# EAGLE design draft1 (EAGLE 6.2)
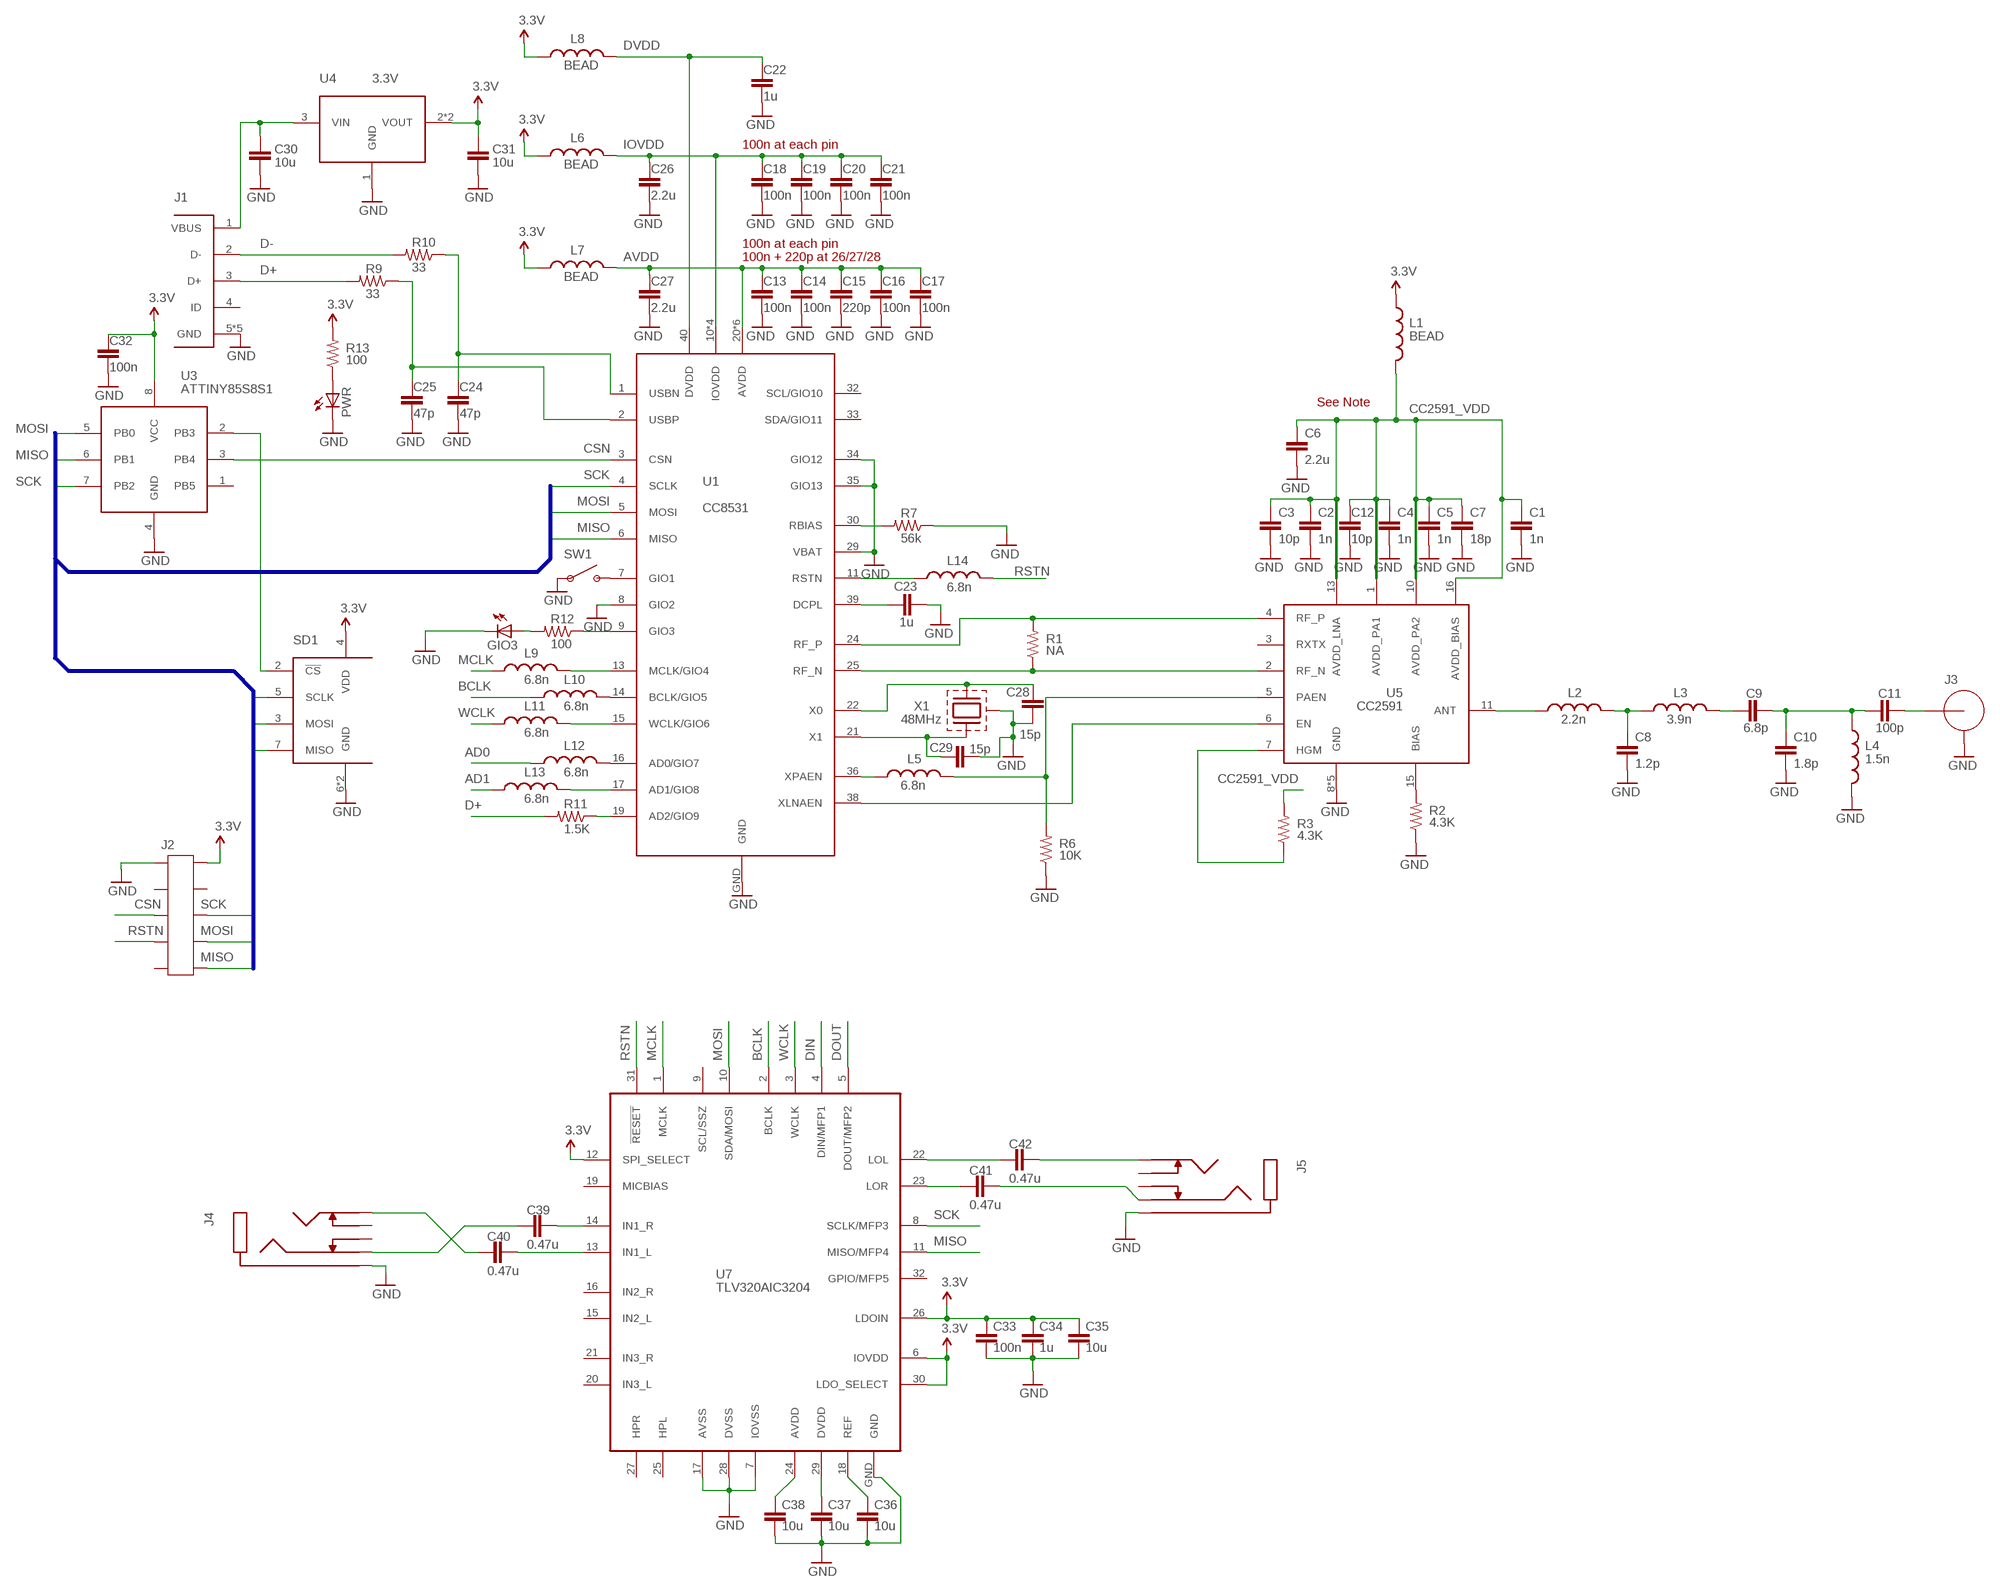
[diagram p0: schematic, sheet 1]

## Parts
C1  1n  C-EUC0603  [C0603]
C2  1n  C-EUC0603  [C0603]
C3  10p  C-EUC0603  [C0603]
C4  1n  C-EUC0603  [C0603]
C5  1n  C-EUC0603  [C0603]
C6  2.2u  C-EUC0603  [C0603]
C7  18p  C-EUC0603  [C0603]
C8  1.2p  C-EUC0603  [C0603]
C9  6.8p  C-EUC0603  [C0603]
C10  1.8p  C-EUC0603  [C0603]
C11  100p  C-EUC0603  [C0603]
C12  10p  C-EUC0603  [C0603]
C13  100n  C-EUC0603  [C0603]
C14  100n  C-EUC0603  [C0603]
C15  220p  C-EUC0603  [C0603]
C16  100n  C-EUC0603  [C0603]
C17  100n  C-EUC0603  [C0603]
C18  100n  C-EUC0603  [C0603]
C19  100n  C-EUC0603  [C0603]
C20  100n  C-EUC0603  [C0603]
C21  100n  C-EUC0603  [C0603]
C22  1u  C-EUC0603  [C0603]
C23  1u  C-EUC0603  [C0603]
C24  47p  C-EUC0603  [C0603]
C25  47p  C-EUC0603  [C0603]
C26  2.2u  C-EUC0603  [C0603]
C27  2.2u  C-EUC0603  [C0603]
C28  15p  C-EUC0603  [C0603]
C29  15p  C-EUC0603  [C0603]
C30  10u  C-EUC0603  [C0603]
C31  10u  C-EUC0603  [C0603]
C32  100n  C-EUC0603  [C0603]
C33  100n  C-EUC0603  [C0603]
C34  1u  C-EUC0603  [C0603]
C35  10u  C-EUC0603  [C0603]
C36  10u  C-EUC0603  [C0603]
C37  10u  C-EUC0603  [C0603]
C38  10u  C-EUC0603  [C0603]
C39  0.47u  C-EUC0603  [C0603]
C40  0.47u  C-EUC0603  [C0603]
C41  0.47u  C-EUC0603  [C0603]
C42  0.47u  C-EUC0603  [C0603]
GIO3  LEDCHIP-LED0603  [CHIP-LED0603]
J1  USB_MICRO_AB  [USB_MICRO_AB]
J2  HEADER-10P-SMD-MALE  [10P-0.05-HEADER]
J3  SMA  [CONSMA003.031]
J4  PHONE_SW  [35RAPC4BV4]
J5  PHONE_SW  [35RAPC4BV4]
L1  BEAD  INDUCTOR0603  [0603]
L2  2.2n  INDUCTOR0603  [0603]
L3  3.9n  INDUCTOR0603  [0603]
L4  1.5n  INDUCTOR0603  [0603]
L5  6.8n  INDUCTOR0603  [0603]
L6  BEAD  INDUCTOR0603  [0603]
L7  BEAD  INDUCTOR0603  [0603]
L8  BEAD  INDUCTOR0603  [0603]
L9  6.8n  INDUCTOR0603  [0603]
L10  6.8n  INDUCTOR0603  [0603]
L11  6.8n  INDUCTOR0603  [0603]
L12  6.8n  INDUCTOR0603  [0603]
L13  6.8n  INDUCTOR0603  [0603]
L14  6.8n  INDUCTOR0603  [0603]
PWR  LEDCHIP-LED0603  [CHIP-LED0603]
R1  NA  R-US_R0603  [R0603]
R2  4.3K  R-US_R0603  [R0603]
R3  4.3K  R-US_R0603  [R0603]
R6  10K  R-US_R0603  [R0603]
R7  56k  R-US_R0603  [R0603]
R9  33  R-US_R0603  [R0603]
R10  33  R-US_R0603  [R0603]
R11  1.5K  R-US_R0603  [R0603]
R12  100  R-US_R0603  [R0603]
R13  100  R-US_R0603  [R0603]
SD1  MICROSDDM3AT  [DM3AT]
SW1  SPST-SMD  [TACT_SW]
U1  CC8531  [S-PVQFN-N40]
U3  ATTINY85S8S1  [SOIC8]
U4  3.3V  NX1117C  [SOT-223]
U5  CC2591  [S-PVQFN-N16]
U7  TLV320AIC3204  [S-PVQFN-N32]
X1  48MHz  XTAL-ABRACONABM3C  [ABM3C]

## Nets
3.3V: C31.1 C32.1 C33.1 C34.1 C35.1 J2.2 L1.1 L6.1 L7.1 L8.1 R13.2 SD1.4(VDD) U3.8(VCC) U4.2(VOUT) U4.4(VOUT) U7.6(IOVDD) U7.12(SPI_SELECT) U7.26(LDOIN) U7.30(LDO_SELECT)
AD0: L12.1
AD1: L13.1
AVDD: C13.1 C14.1 C15.1 C16.1 C17.1 C27.1 L7.2 U1.20(AVDD) U1.23(AVDD) U1.26(AVDD) U1.27(AVDD) U1.28(AVDD) U1.31(AVDD)
BCLK: L10.1 U7.2(BCLK)
CC2591_VDD: C1.1 C2.1 C3.1 C4.1 C5.1 C6.1 C7.1 C12.1 L1.2 R3.2 U5.1(AVDD_PA1) U5.10(AVDD_PA2) U5.13(AVDD_LNA) U5.16(AVDD_BIAS)
CSN: J2.5 U1.3(CSN) U3.3(PB4)
D+: J1.3(D+) R9.2 R11.2
D-: J1.2(D-) R10.2
DIN: U7.4(DIN/MFP1)
DOUT: U7.5(DOUT/MFP2)
DVDD: C22.1 L8.2 U1.40(DVDD)
GND: C1.2 C2.2 C3.2 C4.2 C5.2 C6.2 C7.2 C8.2 C10.2 C12.2 C13.2 C14.2 C15.2 C16.2 C17.2 C18.2 C19.2 C20.2 C21.2 C22.2 C23.2 C24.2 C25.2 C26.2 C27.2 C28.2 C29.2 C30.2 C31.2 C32.2 C33.2 C34.2 C35.2 C36.2 C37.2 C38.2 GIO3.C J1.5(GND) J1.GND1(GND) J1.GND2(GND) J1.GND3(GND) J1.GND4(GND) J2.1 J3.GND1(GND) J3.GND2(GND) J3.GND3(GND) J3.GND4(GND) J4.1(GND) J5.1(GND) L4.2 PWR.C R2.1 R6.1 R7.1 SD1.6(GND) SD1.GND SW1.1 SW1.2 U1.8(GIO2) U1.29(VBAT) U1.34(GIO12) U1.35(GIO13) U1.GND U3.4(GND) U4.1(GND) U5.8(GND) U5.9(GND) U5.12(GND) U5.14(GND) U5.GND U7.7(IOVSS) U7.17(AVSS) U7.28(DVSS) U7.GND X1.2(CASE) X1.4(CASE)
IOVDD: C18.1 C19.1 C20.1 C21.1 C26.1 L6.2 U1.10(IOVDD) U1.12(IOVDD) U1.18(IOVDD) U1.37(IOVDD)
IOVDD1: C24.1 R10.1 U1.1(USBN)
IOVDD2: C25.1 R9.1 U1.2(USBP)
MCLK: L9.1 U7.1(MCLK)
MISO: J2.10 SD1.7(MISO) U1.6(MISO) U3.6(PB1) U7.11(MISO/MFP4)
MOSI: J2.8 SD1.3(MOSI) U1.5(MOSI) U3.5(PB0) U7.10(SDA/MOSI)
N$1: C29.1 U1.21(X1) X1.1
N$2: C28.1 U1.22(X0) X1.3
N$3: L14.1 U1.11(RSTN)
N$4: R1.1 U1.25(RF_N) U5.2(RF_N)
N$5: R1.2 U1.24(RF_P) U5.4(RF_P)
N$6: C30.1 J1.1(VBUS) U4.3(VIN)
N$7: R2.2 U5.15(BIAS)
N$8: R3.1 U5.7(HGM)
N$9: C11.2 J3.SIG
N$10: SD1.2(!CS) U3.2(PB3)
N$11: L5.2 R6.2 U5.5(PAEN)
N$12: C38.1 U7.24(AVDD)
N$13: L2.1 U5.11(ANT)
N$14: C8.1 L2.2 L3.1
N$15: C9.1 L3.2
N$16: C9.2 C10.1 C11.1 L4.1
N$17: U1.38(XLNAEN) U5.6(EN)
N$18: L5.1 U1.36(XPAEN)
N$19: R7.2 U1.30(RBIAS)
N$20: C36.1 U7.18(REF)
N$21: C23.1 U1.39(DCPL)
N$22: L10.2 U1.14(BCLK/GIO5)
N$23: L9.2 U1.13(MCLK/GIO4)
N$24: R11.1 U1.19(AD2/GIO9)
N$25: L11.2 U1.15(WCLK/GIO6)
N$26: L12.2 U1.16(AD0/GIO7)
N$27: L13.2 U1.17(AD1/GIO8)
N$28: R12.1 U1.9(GIO3)
N$29: GIO3.A R12.2
N$30: SW1.3 SW1.4 U1.7(GIO1)
N$31: PWR.A R13.1
N$32: C37.1 U7.29(DVDD)
N$33: C40.1 J4.2(L)
N$34: C39.2 U7.14(IN1_R)
N$35: C40.2 U7.13(IN1_L)
N$36: C39.1 J4.4(R)
N$37: C42.2 J5.2(L)
N$38: C41.2 J5.4(R)
N$39: C42.1 U7.22(LOL)
N$40: C41.1 U7.23(LOR)
RSTN: J2.7 L14.2 U7.31(!RESET)
SCK: J2.6 SD1.5(SCLK) U1.4(SCLK) U3.7(PB2) U7.8(SCLK/MFP3)
WCLK: L11.1 U7.3(WCLK)
Unconnected: J1.4(ID) J2.3 J2.4 J2.9 J4.3(R_SW) J4.5(L_SW) J5.3(R_SW) J5.5(L_SW) U1.32(SCL/GIO10) U1.33(SDA/GIO11) U3.1(PB5) U5.3(RXTX) U7.9(SCL/SSZ) U7.15(IN2_L) U7.16(IN2_R) U7.19(MICBIAS) U7.20(IN3_L) U7.21(IN3_R) U7.25(HPL) U7.27(HPR) U7.32(GPIO/MFP5)

## Buses
SCK,MOSI,MISO

## Notes on the sheet
- 100n at each pin
- 100n at each pin
- 100n + 220p at 26/27/28
- See Note

## Library data of the parts
C1-C42 = rcl:C-EU: CAPACITOR, European symbol
GIO3 PWR = led:LED: LED OSRAM: - CHIPLED LG R971, LG N971, LY N971, LG Q971, LY Q971, LO R971, LY R971 LH N974, LH R974 LS Q976, LO Q976, LY Q976 LO Q996 - Hyper CHIPLED LW Q18S LB Q993, LB Q99A, LB R99A - SideLED LS A670, LO A670, LY A670, LG A670, LP A670 LB A673, LV A673, LT A673, LW A673 LH A674 LY A675 LS A676, LA A676, LO A676, LY A676, LW A676 LS A679, LY A679, LG A679 - Hyper Micro SIDELED® LS Y876, LA Y876, LO Y876, LY Y876 LT Y87S - SmartLED LW L88C, LW L88S LB L89C, LB L89S, LG L890 LS L89K, LO L89K, LY L89K LS L896, LA L896, LO L896, LY L896 - TOPLED LS T670, LO T670, LY T670, LG T670, LP T670 LSG T670, LSP T670, LSY T670, LOP T670, LYG T670 LG T671, LOG T671, LSG T671 LB T673, LV T673, LT T673, LW T673 LH T674 LS T676, LA T676, LO T676, LY T676, LB T676, LH T676, LSB T676, LW T676 LB T67C, LV T67C, LT T67C, LS T67K, LO T67K, LY T67K, LW E67C LS E67B, LA E67B, LO E67B, LY E67B, LB E67C, LV E67C, LT E67C LW T67C LS T679, LY T679, LG T679 LS T770, LO T770, LY T770, LG T770, LP T770 LB T773, LV T773, LT T773, LW T773 LH T774 LS E675, LA E675, LY E675, LS T675 LS T776, LA T776, LO T776, LY T776, LB T776 LHGB T686 LT T68C, LB T68C - Hyper Mini TOPLED® LB M676 - Mini TOPLED Santana® LG M470 LS M47K, LO M47K, LY M47K Source: http://www.osram.convergy.de LUXEON: - LUMILED® LXK2-PW12-R00, LXK2-PW12-S00, LXK2-PW14-U00, LXK2-PW14-V00 LXK2-PM12-R00, LXK2-PM12-S00, LXK2-PM14-U00 LXK2-PE12-Q00, LXK2-PE12-R00, LXK2-PE12-S00, LXK2-PE14-T00, LXK2-PE14-U00 LXK2-PB12-K00, LXK2-PB12-L00, LXK2-PB12-M00, LXK2-PB14-N00, LXK2-PB14-P00, LXK2-PB14-Q00 LXK2-PR12-L00, LXK2-PR12-M00, LXK2-PR14-Q00, LXK2-PR14-R00 LXK2-PD12-Q00, LXK2-PD12-R00, LXK2-PD12-S00 LXK2-PH12-R00, LXK2-PH12-S00 LXK2-PL12-P00, LXK2-PL12-Q00, LXK2-PL12-R00 Source: www.luxeon.com KINGBRIGHT: KA-3528ASYC Source: www.kingbright.com
J1 = 00-EvaLibrary:USB_MICRO_AB
J2 = 00-EvaLibrary:HEADER-10P
J3 = 00-EvaLibrary:SMA
J4 J5 = 00-EvaLibrary:PHONE_SW
L1-L14 = SparkFun:INDUCTOR: Inductors Basic Inductor/Choke - 0603 and 1206. Footprints are not proven and vary greatly between part numbers.
R1-R3 R6 R7 R9-R13 = rcl:R-US_: RESISTOR, American symbol
SD1 = 00-EvaLibrary:MICROSD
SW1 = 00-EvaLibrary:SPST
U1 = 00-EvaLibrary:CC8531
U3 = 00-EvaLibrary:ATTINY85
U4 = 00-EvaLibrary:NX1117C
U5 = 00-EvaLibrary:CC2591
U7 = 00-EvaLibrary:TLV320AIC3204
X1 = 00-EvaLibrary:XTAL-ABRACON

## Board
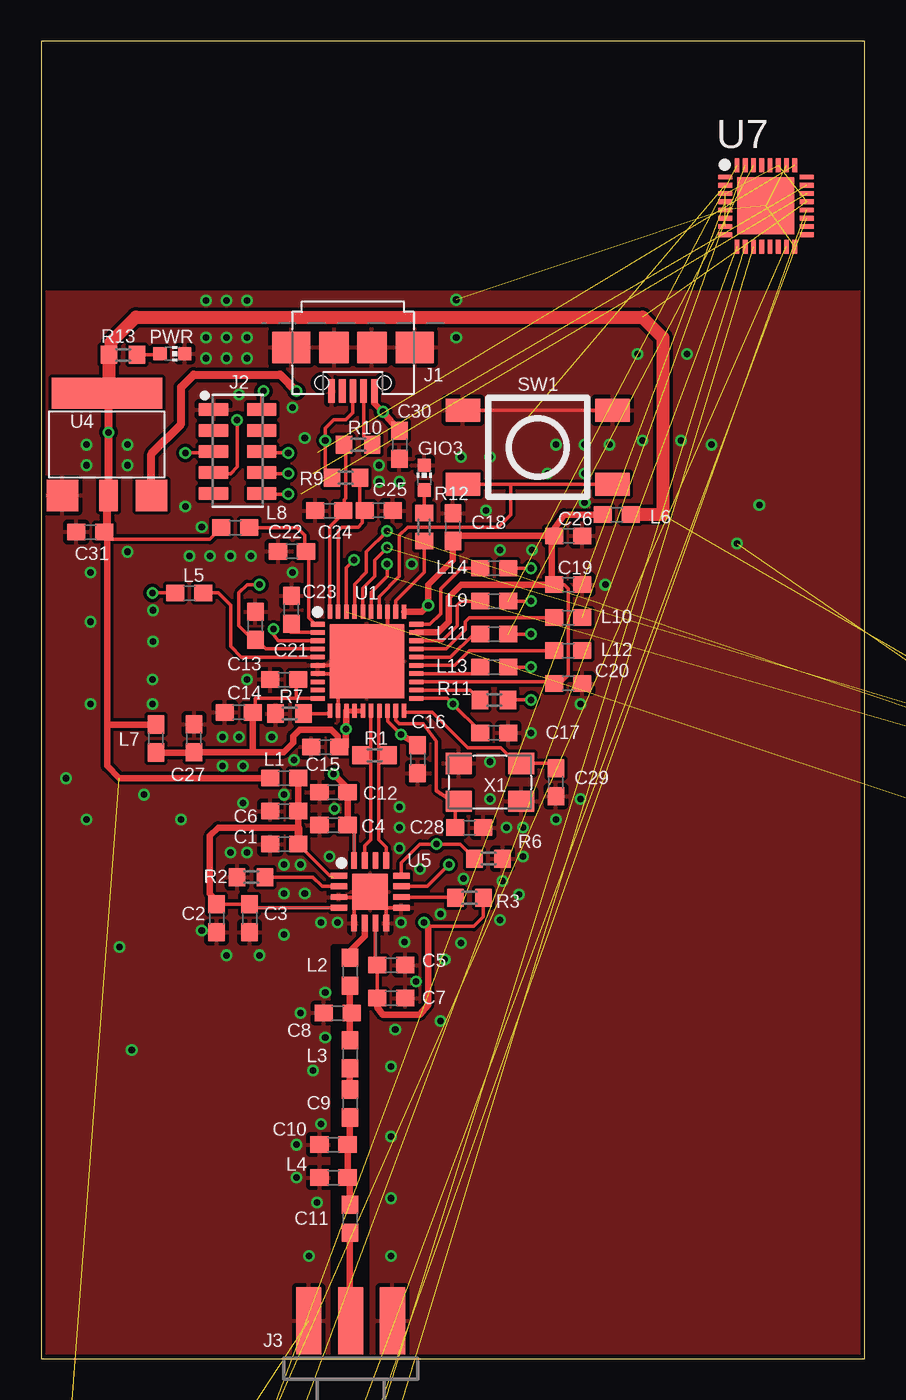
[diagram p1: board, top side]
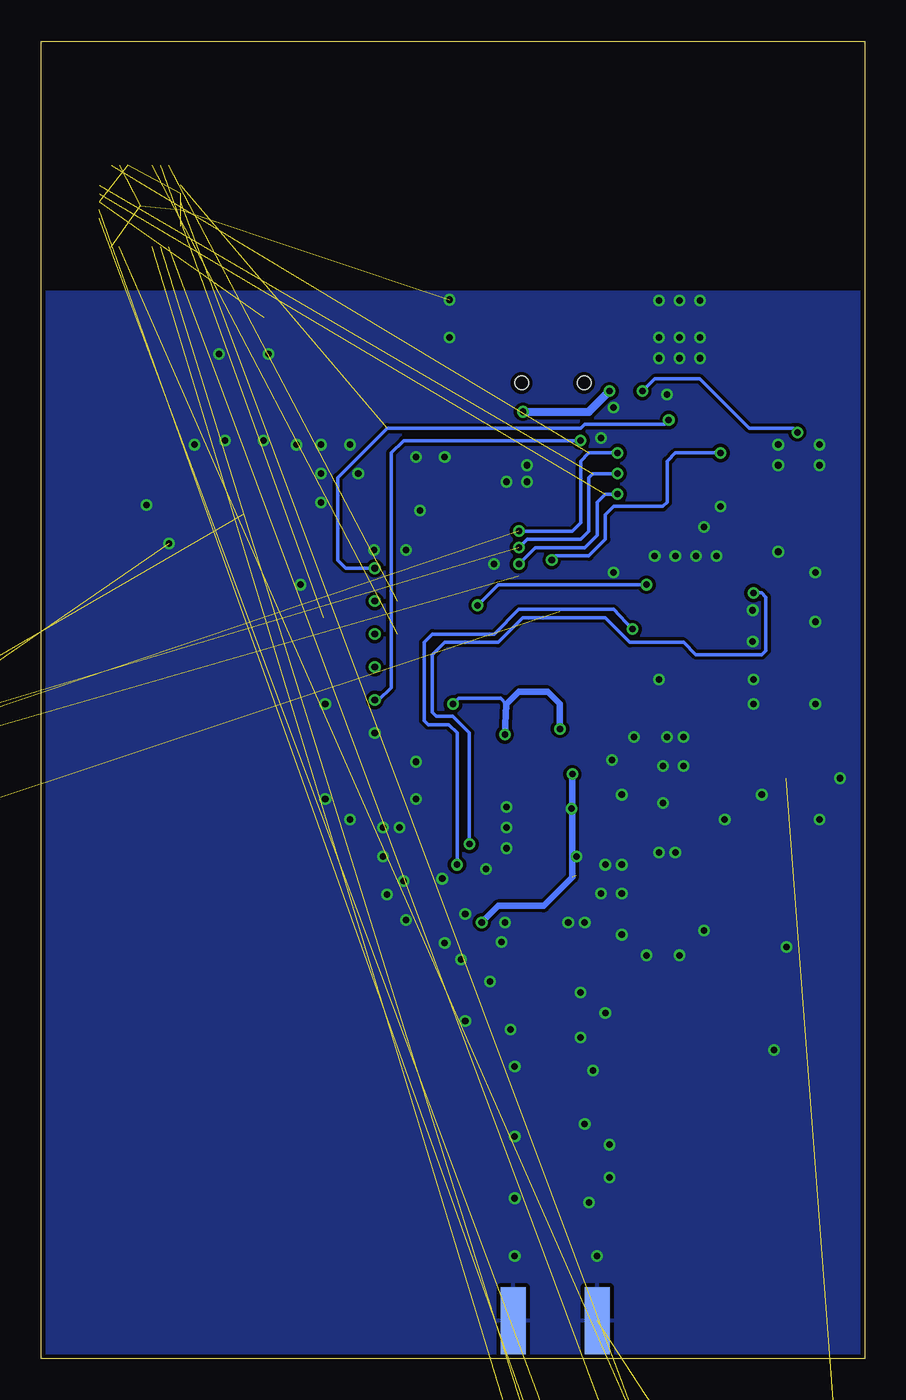
[diagram p2: board, bottom side, seen from below]

Size 50 x 80 mm. Coordinates in mm from the lower left corner, seen from the top.
Outline: 0,0 50,0 50,80 0,80 0,0
Copper layers (1*16): Top 0.035mm / dielectric 1.5mm / Bottom 0.035mm
Design rules: minimum track width 6mil, minimum drill 12mil, track to track 6mil, track to pad 6mil, pad to pad 6mil, via to via 6mil, smd to smd 0mil, copper to edge 10mil, drill to drill 10mil, minimum pad ring 10mil, minimum via ring 6mil, stop-mask expansion 2mil, vias tented up to drill 100mil, thermal gap 10mil
tRestrict: area 17.8,0.2 to 19.8,25

### Footprints (pad centres in the part's own frame; a part is rotated, then mirrored left to right if it is on the bottom)
C0603 = smd 1.1 x 1: 1 -0.85,0; 2 0.85,0
CHIP-LED0603 = smd 0.8 x 0.8: A 0,-0.75; C 0,0.75
USB_MICRO_AB = smd 0.4 x 1.4: 1 -1.3,2.65; 2 -0.65,2.65; 3 0,2.65; 4 0.65,2.65; 5 1.3,2.65 | smd 2.3 x 1.9: GND1 -3.75,0; GND4 3.75,0 | smd 1.8 x 1.9: GND2 -1.15,0; GND3 1.15,0 | hole 0.8: 1.9,2.15; -1.9,2.15
10P-0.05-HEADER = smd 1.778 x 0.762: 1 -1.46,2.54; 2 1.46,2.54; 3 -1.46,1.27; 4 1.46,1.27; 5 -1.46,0; 6 1.46,0; 7 -1.46,-1.27; 8 1.46,-1.27; 9 -1.46,-2.54; 10 1.46,-2.54
CONSMA003.031 = smd 4.064 x 1.524: GND1 0,2.54; GND2 0,-2.54; SIG 0,0 | smd 4.064 x 1.524 bottom: GND3 0,2.54; GND4 0,-2.54
35RAPC4BV4 = drill 1.7 pad 2.4: 1 1.2,-0.85; 2 3.65,1.15; 3 7.35,-0.85; 4 9.25,1.15; 5 13,-0.85
0603 = smd 1.1 x 1: 1 -0.85,0; 2 0.85,0
R0603 = smd 1 x 1.1: 1 -0.85,0; 2 0.85,0
DM3AT = smd 0.7 x 1.2: 1 0,0.6; 2 -1.1,0.6; 3 -2.2,0.6; 4 -3.3,0.6; 5 -4.4,0.6; 6 -5.5,0.6; 7 -6.6,0.6; 8 -7.7,0.6; SW -8.8,0.6 | smd 1 x 1.2: GND 1.55,0.6 | smd 8.7 x 1.6: NC1 -3.85,-5.2 | smd 0.7 x 7.6: NC2 -8.55,-9.5 | smd 0.75 x 8.05: NC3 -9.625,-3.875 | smd 2.55 x 1.35: NC4 1.5,-14.775
TACT_SW = smd 1.4 x 2.1: 1 2.25,4.55; 2 2.25,-4.55; 3 -2.25,4.55; 4 -2.25,-4.55
S-PVQFN-N40 = smd 0.28 x 0.85: 1 -2.25,3; 2 -1.75,3; 3 -1.25,3; 4 -0.75,3; 5 -0.25,3; 6 0.25,3; 7 0.75,3; 8 1.25,3; 9 1.75,3; 10 2.25,3; 21 2.25,-3; 22 1.75,-3; 23 1.25,-3; 24 0.75,-3; 25 0.25,-3; 26 -0.25,-3; 27 -0.75,-3; 28 -1.25,-3; 29 -1.75,-3; 30 -2.25,-3 | smd 0.85 x 0.28: 11 3,2.25; 12 3,1.75; 13 3,1.25; 14 3,0.75; 15 3,0.25; 16 3,-0.25; 17 3,-0.75; 18 3,-1.25; 19 3,-1.75; 20 3,-2.25; 31 -3,-2.25; 32 -3,-1.75; 33 -3,-1.25; 34 -3,-0.75; 35 -3,-0.25; 36 -3,0.25; 37 -3,0.75; 38 -3,1.25; 39 -3,1.75; 40 -3,2.25 | smd 4.5 x 4.5: GND 0,0
SOIC8 = smd 0.5 x 2.2: 1 -1.905,-3.154; 2 -0.645,-3.154; 3 0.625,-3.154; 4 1.895,-3.154; 5 1.905,3.154; 6 0.635,3.154; 7 -0.635,3.154; 8 -1.905,3.154
SOT-223 = smd 1.9 x 1.9: 1 -2.7,-3.1; 3 2.7,-3.1 | smd 1.1 x 1.9: 2 0.1,-3.1 | smd 6.7 x 1.9: 4 0,3.1
S-PVQFN-N16 = smd 0.35 x 1: 1 -0.975,1.9; 2 -0.325,1.9; 3 0.325,1.9; 4 0.975,1.9; 9 0.975,-1.9; 10 0.325,-1.9; 11 -0.325,-1.9; 12 -0.975,-1.9 | smd 1 x 0.35: 5 1.9,0.975; 6 1.9,0.325; 7 1.9,-0.325; 8 1.9,-0.975; 13 -1.9,-0.975; 14 -1.9,-0.325; 15 -1.9,0.325; 16 -1.9,0.975 | smd 2.16 x 2.16: GND 0,0
S-PVQFN-N32 = smd 0.28 x 0.85: 1 -1.75,2.475; 2 -1.25,2.475; 3 -0.75,2.475; 4 -0.25,2.475; 5 0.25,2.475; 6 0.75,2.475; 7 1.25,2.475; 8 1.75,2.475; 17 1.75,-2.475; 18 1.25,-2.475; 19 0.75,-2.475; 20 0.25,-2.475; 21 -0.25,-2.475; 22 -0.75,-2.475; 23 -1.25,-2.475; 24 -1.75,-2.475 | smd 0.85 x 0.28: 9 2.475,1.75; 10 2.475,1.25; 11 2.475,0.75; 12 2.475,0.25; 13 2.475,-0.25; 14 2.475,-0.75; 15 2.475,-1.25; 16 2.475,-1.75; 25 -2.475,-1.75; 26 -2.475,-1.25; 27 -2.475,-0.75; 28 -2.475,-0.25; 29 -2.475,0.25; 30 -2.475,0.75; 31 -2.475,1.25; 32 -2.475,1.75 | smd 3.45 x 3.45: GND 0,0
ABM3C = smd 1.6 x 1.3: 1 -1.9,-1.15; 2 1.9,-1.15; 3 1.9,1.15; 4 -1.9,1.15

### Placement (x,y rotation side)
C1  14.75,31.25 180 top
C2  10.65,26.75 270 top
C3  12.65,26.75 270 top
C4  17.75,32.4 180 top
C5  21.25,23.9 0 top
C6  14.75,33.25 180 top
C7  21.25,21.9 0 top
C8  18,21 180 top
C9  18.75,15.5 270 top
C10  17.75,13 180 top
C11  18.75,8.5 270 top
C12  17.75,34.4 180 top
C13  14.75,41.25 180 top
C14  12,39.25 180 top
C15  17.25,37.15 180 top
C16  22.85,36.4 270 top
C17  27.5,38 0 top
C18  25,50.5 90 top
C19  32,47 0 top
C20  32,41 0 top
C21  13,44.5 90 top
C22  15.23,49.03 180 top
C23  15.2,45.49 90 top
C24  17.5,51.5 180 top
C25  20.5,51.5 0 top
C26  32.01,49.97 0 top
C27  9.28,37.68 90 top
C28  26,32.25 0 top
C29  31.25,35 270 top
C30  21.75,55.5 270 top
C31  2.99,50.2 180 top
C32  80.86,20.12 90 top  (outside the outline)
C33  1.5,-19 0 top  (outside the outline)
C34  1.5,-24 0 top  (outside the outline)
C35  1.5,-29 0 top  (outside the outline)
C36  1.5,-34 0 top  (outside the outline)
C37  1.5,-39 0 top  (outside the outline)
C38  1.5,-44 0 top  (outside the outline)
C39  1.5,-49 0 top  (outside the outline)
C40  1.5,-54 0 top  (outside the outline)
C41  1.5,-67.5 0 top  (outside the outline)
C42  1.5,-72.5 0 top  (outside the outline)
GIO3  23.25,53.5 0 top
J1  18.93,61.41 180 top
J2  11.93,55.09 0 top
J3  18.79,2.32 90 top
J4  4,-60 0 top  (outside the outline)
J5  4,-78.5 0 top  (outside the outline)
L1  14.75,35.25 0 top
L2  18.75,23.5 270 top
L3  18.75,18.5 270 top
L4  17.75,11 180 top
L5  9,46.5 180 top
L6  34.95,51.25 180 top
L7  6.96,37.66 270 top
L8  11.78,50.46 0 top
L9  27.5,46 180 top
L10  32,45 180 top
L11  27.5,44 180 top
L12  32,43 180 top
L13  27.5,42 180 top
L14  27.5,48 0 top
PWR  7.96,61.02 270 top
R1  20.25,36.65 0 top
R2  12.75,29.25 0 top
R3  26,28 0 top
R6  27.17,30.37 180 top
R7  15.09,39.18 0 top
R9  18.5,53.5 180 top
R10  19.25,55.5 0 top
R11  27.5,40 0 top
R12  23.25,50.5 90 top
R13  4.98,60.95 180 top
SD1  67.22,35.51 0 top  (outside the outline)
SW1  30.15,55.34 90 top
U1  19.78,42.35 0 top
U3  80.98,27.58 0 top  (outside the outline)
U4  3.99,55.52 0 top
U5  19.97,28.36 0 top
U7  44,70 0 top
U$1  [TRANS]  71.15,9.2 0 top  (outside the outline)
X1  27.25,35 180 top

### Tracks (layer width: path | path; a pad name or v marks a point on that pad's centre or on a via)
3.3V  (via drill 0.4)  (10 unrouted)
  Top 0.2: 4,58 4.13,58.13 4.13,58.48 U4.4 | J2.2 13.39,58.64 v13.5,58.75 | 4.21,50.46 4,50.25 | 4,50.75 4,50.36 C31.1 4.29,49.75 10.25,49.75 10.93,50.43 L8.1
  Top 0.4: 4,38.51 4,50.25 4,50.75 | L1.1 4.75,35.25 4,36 4,38.51 | L7.1 4,38.51 | 4.25,61.07 R13.2 | 4.13,58.76 U4.4
  Top 0.5: U4.4 4.09,58.52 v4.09,56.25 U4.2 4,52.33 4,50.75
  Top 0.8: 4.13,58.76 R13.2 | 4.25,61.07 4.25,61.75 5.75,63.25 36.5,63.25 37.75,62 37.75,51.25 L6.1
  Bottom 0.2: v4.09,56.25 4.34,56.5 7,56.5 10,59.5 12.75,59.5 v13.5,58.75
AD1  (via drill 0.4)
  Top 0.2: L13.1 v29.75,42
AVDD  (via drill 0.4)
  Top 0.2: U1.23 21.03,38.72 v21.85,37.9 | C14.1 13,39.4 13,40.1 15.5,40.1 | U1.31 15.5,40.1 | v25,39.75 24.75,40 | U1.20 24.65,40.1 v25,39.75 | C17.1 26.65,38.1 v25,39.75 | C13.1 15.5,41.15 15.5,40.1
  Top 0.3: U1.28 U1.27 U1.26
  Top 0.4: C16.1 22.75,37.25 22.5,37.5 v21.85,37.9 | U1.28 18.53,38.28 v18.5,38.25 18.5,37.15 C15.1 | L7.2 9.26,36.81 C27.1 12.75,36.83 | 12.75,36.83 14.73,36.83 15.3,37.4 15.3,37.8 15.7,38.2 17.6,38.2 18,37.8 18,37.25 C15.1 | C15.1 18.1,36.9 | C14.1 12.85,36.93 12.75,36.83
  Bottom 0.2: v25,39.75 24.65,40.1 22.1,40.1 21.75,39.75
  Bottom 0.4: v21.85,37.9 21.75,39.75 21,40.5 19.25,40.5 18.53,39.78 18.53,38.28 v18.5,38.25
BCLK  (1 unrouted)
CC2591_VDD  (via drill 0.4)  (1 unrouted)
  Top 0.2: U5.10 20.3,24 C5.1 C7.1 | U5.16 17.52,29.34 C1.1 | 10.9,27.6 C2.1 C3.1 12.87,27.39 U5.13 | R3.2 26.85,26.85 26.25,26.25 23.5,26.25 | U5.1 19,32.1 C4.1
  Top 0.4: 10.9,27.6 10.25,28.25 10.25,31.75 10.75,32.25 15.6,32.25 C6.1 L1.2 15.88,35.52 | C7.1 20.4,21.35 20.75,20.9 23,20.9 23.5,21.5 23.5,26.25 v23.25,26.5 | C4.1 C12.1 18.6,34.65 v17.75,35.5
  Top 0.5: 15.6,32.25 C1.1
  Bottom 0.4: v17.75,35.5 17.75,29.25 19.5,27.5 22.25,27.5 v23.25,26.5
CSN  (via drill 0.4)  (1 unrouted)
  Top 0.2: v8.75,55 10.56,55 J2.5 | U1.3 18.53,48.03 v19,48.5
  Bottom 0.2: v8.75,55 11.5,55 12,54.5 12,52 12.25,51.75 15.25,51.75 15.75,51.25 15.75,49.75 16.75,48.75 18.75,48.75 v19,48.5
D+  (via drill 0.4)
  Top 0.2: J1.3 18.93,57.43 18.5,57 17.75,57 17.25,56.5 v17.25,55.75 17.25,53.9 R9.2 | R11.2 v29.75,40
  Bottom 0.2: v29.75,40 29.5,40 28.75,40.75 28.75,55 28,55.75 v17.25,55.75
D-
  Top 0.2: J1.2 19.58,56.02 R10.2
DVDD
  Top 0.2: U1.40 16.65,44.6 16.25,45 16.25,48.86 C22.1 16,49.11 16,50 15.54,50.46 L8.2
GND  (via drill 0.4)  (16 unrouted)
  Top 0.2: U5.12 19,27.39 U5.GND | U5.14 19.64,28.04 U5.GND | U5.9 20.95,27.39 | 20.95,27.39 U5.GND | U5.8 20.95,27.39 | U1.35 19,42.1 | 19,42.1 19.53,42.1 U1.GND 20.93,43.5 21,43.5 21.03,43.53 U1.8 | U1.34 18.5,41.6 | 18.5,41.6 19,42.1 | U1.29 18.03,41.13 18.5,41.6 | SW1.2 SW1.1
  other vias: 10,60.75 11.25,60.75 12.5,60.75 10,62 11.25,62 12.5,62 15.25,57.75 20.5,53.25 21.75,53.25 20.5,54.25 14,37.75 12.75,48.75 11.5,48.75 10.25,48.75 9,48.75 5.25,49 8.75,51.75 5.25,55.5 5.25,54.25 22.5,48.25 25.5,54.75 27.25,54.75 27.85,49.1 34.25,47 6.75,39.75 6.75,41.25 17.5,30.5 15.75,30 14.75,30 16,28.25 14.75,28.25 18,26.5 17,26.5 24.25,27 21.85,26.5 21.75,31 21.75,32.25 21.75,33.5 28,29 29.25,30.5 28.25,32.25 14.75,25.75 13.25,24.5 11.25,24.5 9.75,26 32.75,39.75 29.75,38 32.75,34 31.25,32.75 29.25,32.25 27.25,34 12,58.55 2.75,55.5 2.75,54.25 33,52 42.25,49.5 12.25,33.75 12.5,30.75 11.5,30.75 4.75,25 5.5,18.75 17.25,22.25 15.75,21 17.25,19.5 22.75,22.9 15.5,13 17,14.25 15.5,11 16.75,9.5 36.5,55.75 33,53.75 30.75,53.75 34.5,55.5 33,55.5 31.25,55.5 24.5,24.25 21.5,20 24.25,20.5 27.85,26.65 21.25,17.75 21.25,13.5 21.25,9.75 21.25,6.25 16.5,17.5 16.25,6.25 6.25,34.25 1.5,35.25 3,47.75 3,44.75 3,39.75 2.75,32.75 8.5,32.75 27.25,36.25 15.25,47.75 27,51.5 11,37.75 11,36 22.05,25.3 17.8,33.4 14.75,34.25 15.35,36.35 38.85,55.75 40.7,55.5 43.6,51.85 6.8,45.45 6.8,43.55 9.75,50.5 29.8,49.1 29,28.2 16,55.9 25.2,62 36.2,61 39.2,61 25.2,64.3 10,64.25 11.25,64.25 12.5,64.25 25.5,25.25 12.5,41.25 12,37.75 12.25,36 25.65,29.15 23,29.75
  pour Top (isolate 0.2): 0,64.75 50,64.75 50,0 0,0
  pour Bottom (isolate 0.2): 0,64.75 50,64.75 50,0 0,0
IOVDD  (via drill 0.4)
  Top 0.2: U1.18 31.25,41.1 | 31.25,41.1 31.6,41.1 32,41.5 32,46.75 31.75,47 C19.1 | 13,43.75 C21.1 | C26.1 31.16,50.41 | U1.37 13.65,43.1 13,43.75 | C20.1 31.25,41.1 | 25.32,49.97 C18.1 | 13,43.75 12.75,43.75 12,44.5 12,46.5 12.5,47 v13.25,47
  Top 0.4: U1.12 24.1,44.1 24.75,44.75 24.75,46.25 25.5,47 31,47 | U1.10 23.1,45.35 v23.5,45.75 23.5,47 25,48.5 C18.1 | C19.1 31,47 | 31,47 31,49.97 | 31.16,50.41 31.75,51.25 L6.2 | C26.1 31,49.97 | 31,49.97 25.32,49.97
  Bottom 0.2: v13.25,47 22.25,47 v23.5,45.75
IOVDD1
  Top 0.2: R10.1 18.5,55.4 18.5,52.25 18.4,52.15 18.4,51.55 C24.1 18,51.15 18,51 17.53,50.53 U1.1
IOVDD2
  Top 0.2: R9.1 19.35,51.8 C25.1 19.5,51.35 19.5,50.75 19.25,50.5 18.25,50.5 18.03,50.28 U1.2
MCLK  (via drill 0.4)  (1 unrouted)
  Top 0.2: L9.1 v29.75,46
MISO  (via drill 0.4)  (3 unrouted)
  Top 0.2: v15,52.5 13.44,52.5 J2.10 | U1.6 20.03,46.53 21,47.5 v21,48.25
  Bottom 0.2: v15,52.5 15.75,52.5 16.25,52 16.25,50 17,49.25 20,49.25 v21,48.25
MOSI  (via drill 0.4)  (3 unrouted)
  Top 0.2: v15,53.75 13.46,53.75 J2.8 | U1.5 19.53,46.78 20.25,47.5 20.25,48.5 v21,49.25
  Bottom 0.2: 15.25,53.75 v15,53.75 16.5,53.75 16.75,53.5 16.75,50.25 17.25,49.75 20.5,49.75 v21,49.25
N$1
  Top 0.2: C29.1 31.2,36.15 X1.1 28.85,36.15 27.9,37.1 25.9,37.1 23.75,39.25 22.13,39.25 U1.21
N$2
  Top 0.2: U1.22 21.53,38.77 21.75,38.55 23.2,38.55 24,37.5 24,34.5 24.75,34 25.25,34 X1.3 25.15,33.9 C28.1
N$3
  Top 0.2: U1.11 23.6,44.6 24.25,45.25 24.25,46.75 25.5,48 L14.1
N$4
  Top 0.2: U5.2 19.64,31.14 20,31.5 20,36.25 | 20,36.25 20,38.57 U1.25 | R1.1 20,36.25
N$5
  Top 0.2: U5.4 20.95,31.05 20.5,31.5 20.5,36.25 | 20.5,36.25 20.5,38.57 U1.24 | R1.2 20.5,36.25
N$6  (via drill 0.4)
  Top 0.4: J1.1 20.23,58.02 v20.75,57.5 C30.1
  Top 0.5: U4.3 6.69,54.94 8.5,56.75 8.5,59 9.25,59.75 14.5,59.75 v15.5,58.75
  Bottom 0.5: v20.75,57.5 16.75,57.5 v15.5,58.75
N$7
  Top 0.2: U5.15 17.07,28.68 16.5,29.25 R2.2
N$8
  Top 0.2: U5.7 25.11,28.04 R3.1
N$9
  Top 0.4: C11.2 18.75,4.61 J3.SIG
N$10  (1 unrouted)
N$11  (via drill 0.4)
  Top 0.2: R6.2 25.44,31.25 v24,31.25 23,31.25 21.87,30.12 U5.5 | v6.75,46.5 L5.2
  Bottom 0.2: v24,31.25 24,38 25,39 26,39 26.25,39.25 26.25,42.75 25.5,43.5 22.25,43.5 20.75,45 15.75,45 14.25,43.5 11,43.5 10.25,42.75 6.25,42.75 6,43 6,46.25 6.25,46.5 v6.75,46.5
N$12  (1 unrouted)
N$13
  Top 0.4: U5.11 19.64,25.64 18.75,24.75 L2.1
N$14
  Top 0.4: L2.2 18.75,21.1 C8.1 18.75,20.9 L3.1
N$15
  Top 0.4: L3.2 C9.1
N$16
  Top 0.4: C9.2 18.75,13.15 C10.1 L4.1 18.75,10.85 C11.1
N$17  (via drill 0.4)
  Top 0.2: U5.6 23.43,28.68 v24.75,30 | v14.1,44.3 14.1,44 14.4,43.6 U1.38
  Bottom 0.2: v24.75,30 24.75,38 25.25,38.5 26.5,38.5 26.75,38.75 26.75,43.5 26.25,44 22.5,44 21,45.5 15.25,45.5 v14.1,44.3
N$18
  Top 0.2: U1.36 12.15,42.6 11.5,43.25 11.5,45.75 10.75,46.5 L5.1
N$19
  Top 0.2: R7.2 17.36,39.18 U1.30
N$20  (1 unrouted)
N$21
  Top 0.2: U1.39 15.15,44.1 15,44.25 15,44.44 C23.1
N$22
  Top 0.2: U1.14 24.6,43.1 25.75,44.25 25.75,44.75 26,45 L10.2
N$23
  Top 0.2: U1.13 24.35,43.6 25.25,44.5 25.25,45.75 25.5,46 L9.2 26.75,46
N$24
  Top 0.2: U1.19 26.05,40.6 R11.1
N$25
  Top 0.2: U1.15 24.85,42.6 26.25,44 L11.2
N$26
  Top 0.2: U1.16 25.1,42.1 26,43 L12.2
N$27
  Top 0.2: U1.17 26.1,41.6 26.5,42 L13.2
N$28
  Top 0.2: U1.9 21.53,46.03 23.25,47.75 R12.1
N$29
  Top 0.2: R12.2 GIO3.A
N$30
  Top 0.2: SW1.3 28.5,53.09 | 28.5,53.09 SW1.4 | 28.5,53.09 28.5,51.25 27.75,50.5 22.25,50.5 21.75,50 21.75,47.5 20.53,46.28 U1.7
N$31
  Top 0.2: R13.1 7.14,60.95 PWR.A
N$32  (1 unrouted)
N$33  (1 unrouted)
N$34  (1 unrouted)
N$35  (1 unrouted)
N$36  (1 unrouted)
N$37  (1 unrouted)
N$38  (1 unrouted)
N$39  (1 unrouted)
N$40  (1 unrouted)
RSTN  (via drill 0.4)  (1 unrouted)
  Top 0.2: L14.2 v29.75,48 | v11.9,57 11.9,54.15 11.5,53.75 10.54,53.75 J2.7
  Bottom 0.2: v11.9,57 12.15,56.75 17,56.75 17.25,56.5 29,56.5 32,53.5 32,48.5 31.5,48 v29.75,48
SCK  (via drill 0.4)  (3 unrouted)
  Top 0.2: 20.75,50 v21,50.25 19.75,49 19.75,47.75 19.03,47.03 U1.4 | v15,55 13.48,55 J2.6
  Bottom 0.2: v21,50.25 17.75,50.25 17.25,50.75 17.25,54.5 16.75,55 v15,55
WCLK  (via drill 0.4)  (1 unrouted)
  Top 0.2: L11.1 v29.75,44

### Text on the board
tDocu: AVDD_PA1 | 1.13mm | AVDD_LNA | 4.33mm | 1.49mm | AVDD_PA2